# Altium schematic sheet ISO_I2C.SchDoc
size A4; SheetNumber: 2; SheetTotal: 3
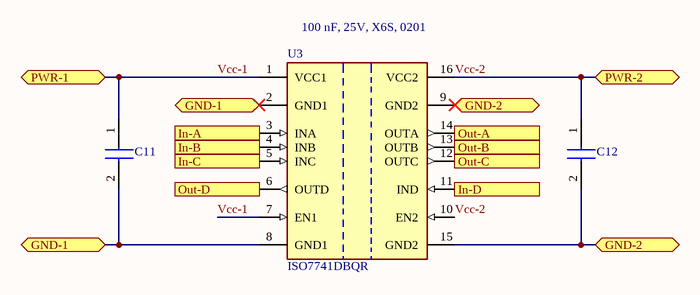
[diagram p0: ISO_I2C.SchDoc]

## Parts
C11  100 nF, 25V, X6S, 0201  [CAPC0603X33N]  (value not drawn)
C12  100 nF, 25V, X6S, 0201  [CAPC0603X33N]  (value not drawn)
U3  ISO7741DBQR  [FP-DBQ0016A-MFG]

## Ports
GND-1 (bidir, see MainShunt[1B]), GND-2 (bidir, see MainShunt[1B]), In-A (in, see MainShunt[1B]), In-B (in, see MainShunt[1B]), In-C (in, see MainShunt[1B]), In-D (in, see MainShunt[1B]), Out-A (out, see MainShunt[1B]), Out-B (out, see MainShunt[1B]), Out-C (out, see MainShunt[1B]), Out-D (out, see MainShunt[1B]), PWR-1 (bidir, see MainShunt[1B]), PWR-2 (bidir, see MainShunt[1B])

## Nets
GND-1: C11.2 U3.2(GND1) U3.8(GND1) ; port GND-1
GND-2: C12.2 U3.9(GND2) U3.15(GND2) ; port GND-2
In-A: U3.3(INA) ; port In-A
In-B: U3.4(INB) ; port In-B
In-C: U3.5(INC) ; port In-C
In-D: U3.11(IND) ; port In-D
Out-A: U3.14(OUTA) ; port Out-A
Out-B: U3.13(OUTB) ; port Out-B
Out-C: U3.12(OUTC) ; port Out-C
Out-D: U3.6(OUTD) ; port Out-D
Vcc-1: C11.1 U3.1(VCC1) U3.7(EN1) ; port PWR-1
Vcc-2: C12.1 U3.10(EN2) U3.16(VCC2) ; port PWR-2

## Notes on the sheet
- (near U3) 100 nF, 25V, X6S, 0201

## Library data of the parts
C11 C12 = GRM033C81E104KE14D: Capacitor; Manufacturer_Name: Murata Electronics; Datasheet Link: https://search.murata.co.jp/Ceramy/image/img/A01X/G101/ENG/GRM033C81E104KE14-01A.pdf; Height: 0.33mm; Manufacturer_Part_Number: GRM033C81E104KE14D; Mouser Part Number: 81-GRM33C81E104KE14D; Mouser Price/Stock: https://www.mouser.co.uk/ProductDetail/Murata-Electronics/GRM033C81E104KE14D?qs=P%2FC4Eoq9CDwxe7d5nXqGrA%3D%3D; Arrow Part Number: GRM033C81E104KE14D; Arrow Price/Stock: https://www.arrow.com/en/products/grm033c81e104ke14d/murata-manufacturing
U3 = CMP-04872-000008-1: Manufacturer: Texas Instruments; Nominal Supply Current: 0.8-18mA; Standoff Height: 0.11mm; Interface: SPI; Max Supply Voltage: 5.5V; Min Supply Voltage: 2.25V; Max Junction Temp: +150°C; Automotive: No; Ambient Temperature Range High: +125°C; Height: 1.75mm; Octopart: https://octopart.com/iso7741dbqr-texas+instruments-82338409; Temperature Range High: +125°C; Device Class L1: Integrated Circuits (ICs); Lead Free: Yes; Ambient Temperature Range Low: -55°C; Digikey Description: ISO7741DBQR; Package: DBQ0016A; Temperature: -55°C to +125°C; ComponentLink2URL: http://www.ti.com/lit/ds/symlink/iso7741.pdf; Category: IC; Manufacturer Part Number: ISO7741DBQR; Device Class L2: Interface ICs; Mouser Description: High-speed, low-power, robust EMC quad-channel digital isolator 16-SSOP -55 to 125; ComponentLink2Description: Datasheet; Temperature Range Low: -55°C; Device Class L3: unset; RoHS: TRUE